# Altium project Header-PinHeader.PrjPCB
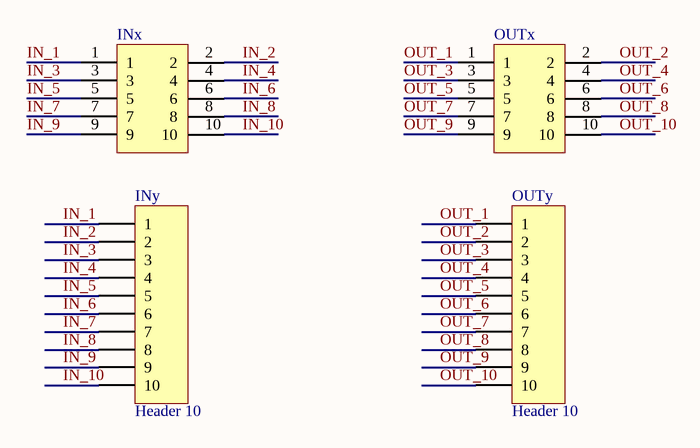
[diagram p0: Header-PinHeader.SchDoc]
1 sheet, 4 parts. Net scope: global (net labels, ports and power ports of the same name join across sheets).
Board file: Header-PinHeader.PcbDoc

## Sheet Header-PinHeader.SchDoc
size A4

### Parts
INx  10 pol Header  [10 pol Header]  (value not drawn)
INy  Header 10  [HDR1X10]
OUTx  10 pol Header  [10 pol Header]  (value not drawn)
OUTy  Header 10  [HDR1X10]

### Nets
IN_1: INx.1 INy.1
IN_2: INx.2 INy.2
IN_3: INx.3 INy.3
IN_4: INx.4 INy.4
IN_5: INx.5 INy.5
IN_6: INx.6 INy.6
IN_7: INx.7 INy.7
IN_8: INx.8 INy.8
IN_9: INx.9 INy.9
IN_10: INx.10 INy.10
OUT_1: OUTx.1 OUTy.1
OUT_2: OUTx.2 OUTy.2
OUT_3: OUTx.3 OUTy.3
OUT_4: OUTx.4 OUTy.4
OUT_5: OUTx.5 OUTy.5
OUT_6: OUTx.6 OUTy.6
OUT_7: OUTx.7 OUTy.7
OUT_8: OUTx.8 OUTy.8
OUT_9: OUTx.9 OUTy.9
OUT_10: OUTx.10 OUTy.10

### Library data of the parts
INy OUTy = Header 10: Header, 10-Pin; LatestRevisionDate: 17-Jul-2002; LatestRevisionNote: Re-released for DXP Platform.; Publisher: Altium Limited
INx OUTx = 10 pol Header: LatestRevisionDate: 2012-06-14; Publisher: NONLINEAR LABS